# EAGLE design IPNS_v0.2 (EAGLE 8.0.0)
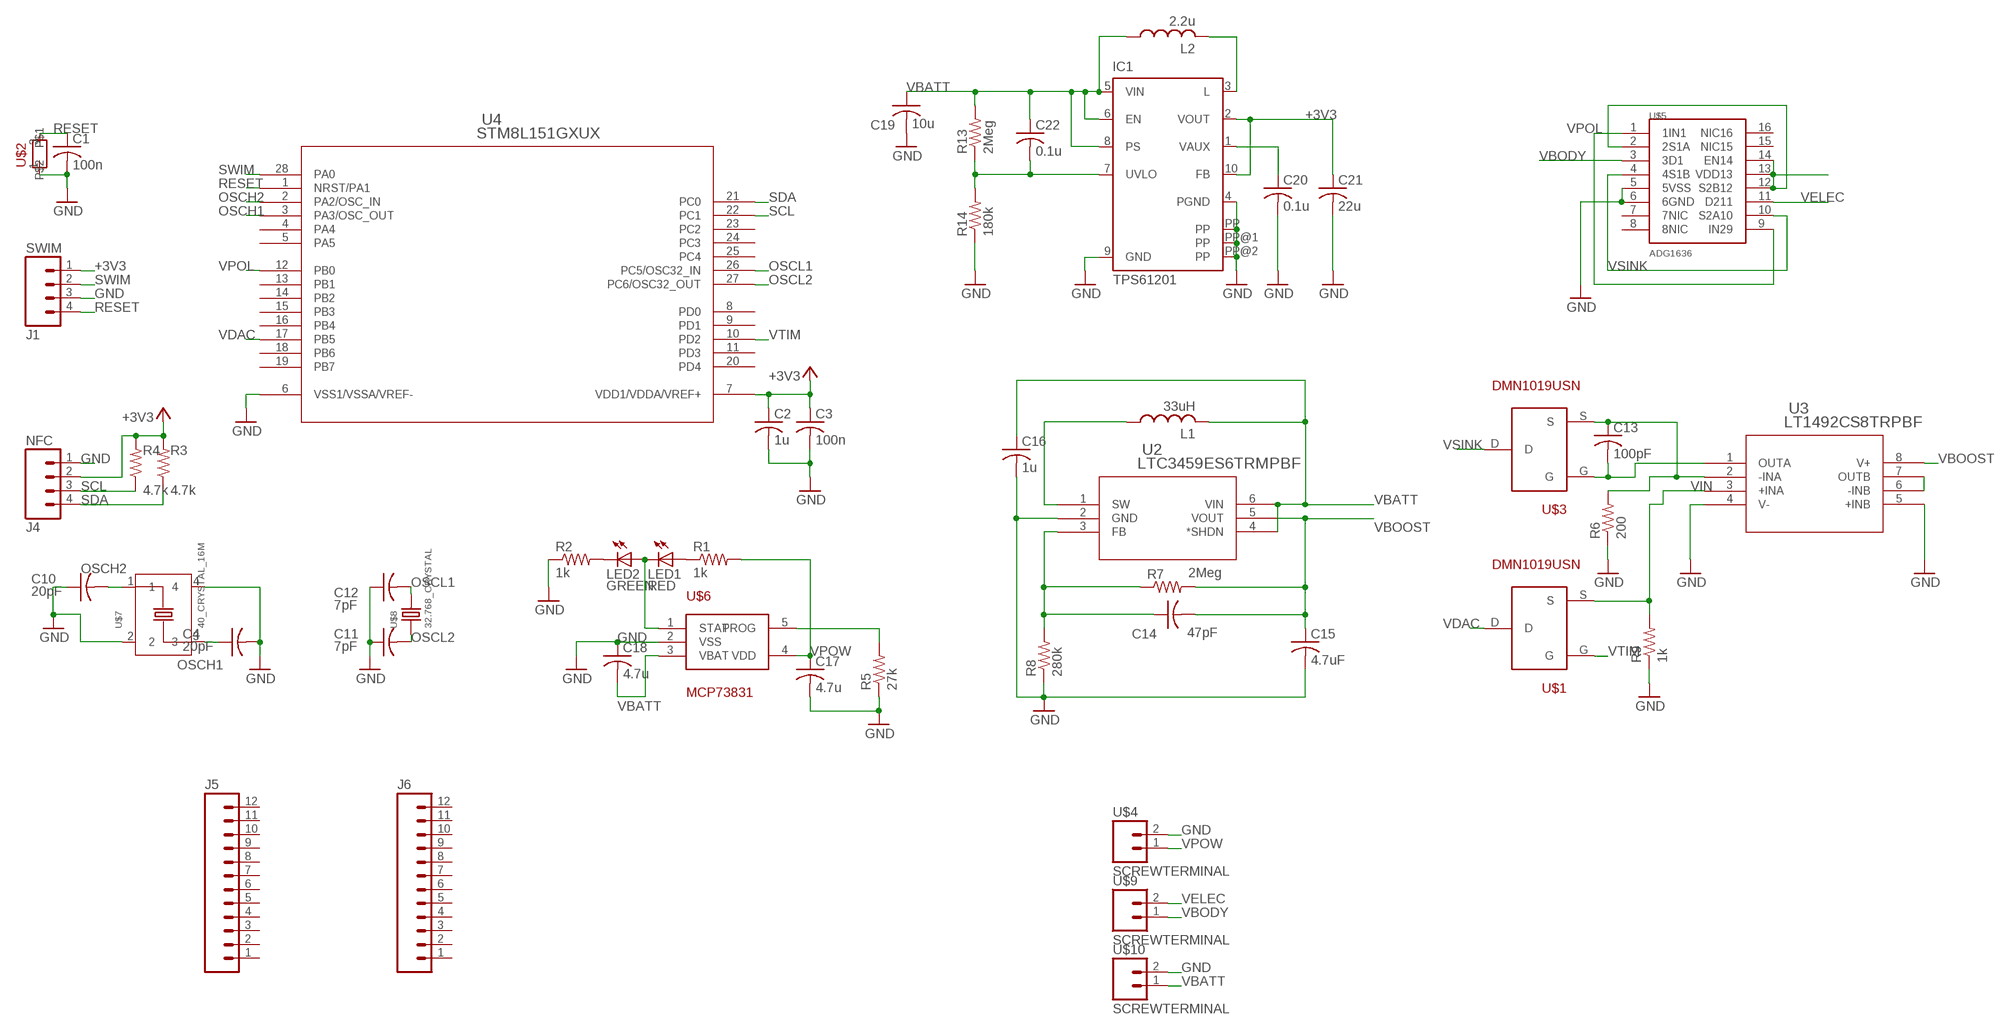
[diagram p0: schematic, sheet 1]

## Parts
C1  100n  C-USC0603  [C0603]
C2  1u  C-USC0603  [C0603]
C3  100n  C-USC0603  [C0603]
C4  20pF  C-USC0603  [C0603]
C10  20pF  C-USC0603  [C0603]
C11  7pF  C-USC0603  [C0603]
C12  7pF  C-USC0603  [C0603]
C13  100pF  C-USC0603  [C0603]
C14  47pF  C-USC0603  [C0603]
C15  4.7uF  C-USC0603  [C0603]
C16  1u  C-USC0603  [C0603]
C17  4.7u  C-USC0603  [C0603]
C18  4.7u  C-USC0603  [C0603]
C19  10u  C-USC0603  [C0603]
C20  0.1u  C-USC0603  [C0603]
C21  22u  C-USC0603  [C0603]
C22  0.1u  C-USC0603  [C0603]
IC1  TPS61201  TPS61200  [S-PDSO-N10]
J1  SWIM  M04PTH  [1X04]
J4  NFC  M04PTH  [1X04]
J5  M12PTH  [1X12]
J6  M12PTH  [1X12]
L1  33uH  L-USL2012C  [L2012C]
L2  2.2u  L-USL2012C  [L2012C]
LED1  RED  LEDSML0603  [SML0603]
LED2  GREEN  LEDSML0603  [SML0603]
R1  1k  R-US_R0603  [R0603]
R2  1k  R-US_R0603  [R0603]
R3  4.7k  R-US_R0603  [R0603]
R4  4.7k  R-US_R0603  [R0603]
R5  27k  R-US_R0603  [R0603]
R6  200  R-US_R0603  [R0603]
R7  2Meg  R-US_R0603  [R0603]
R8  280k  R-US_R0603  [R0603]
R9  1k  R-US_R0603  [R0603]
R13  2Meg  R-US_R0603  [R0603]
R14  180k  R-US_R0603  [R0603]
U2  LTC3459ES6TRMPBF  [TSOT-23_S6]
U3  LT1492CS8TRPBF  [SO-8_S]
U4  STM8L151GXUX  [UFQFPN-28]
U$1  DMN1019USN  [DMN1019USN]
U$2  PUSH-BUTTON  [PUSH-BUTTON]
U$3  DMN1019USN  [DMN1019USN]
U$4  SCREWTERMINAL  [SCREWTERMINAL]
U$5  ADG1636  [TSSOP16]
U$6  MCP78381  [SOT23-5L]
U$7  40_CRYSTAL_16M  [X4-SMD-3.2X2.5X0.7MM]
U$8  32.768_CRYSTAL  [X2-SMD-3.2X1.5X0.55MM]
U$9  SCREWTERMINAL  [SCREWTERMINAL]
U$10  SCREWTERMINAL  [SCREWTERMINAL]

## Nets
+3V3: C2.1 C3.1 C21.1 IC1.2(VOUT) IC1.10(FB) J1.1 J4.2 R3.2 R4.2 U4.7(VDD1/VDDA/VREF+)
GND: C1.2 C2.2 C3.2 C4.2 C10.1 C11.1 C12.1 C15.2 C16.2 C17.2 C18.1 C19.2 C20.2 C21.2 IC1.4(PGND) IC1.9(GND) IC1.PP IC1.PP@1(PP) IC1.PP@2(PP) J1.3 J4.1 R2.1 R5.1 R6.1 R8.1 R9.1 R14.1 U2.2(GND) U3.4(V-) U3.5(+INB) U4.6(VSS1/VSSA/VREF-) U$2.1 U$4.2 U$5.5(5VSS) U$5.6(6GND) U$6.2(VSS) U$7.2 U$7.4 U$10.2
N$1: LED1.C LED2.A U$6.1(STAT)
N$2: C13.1 R6.2 U3.2(-INA) U$3.S
N$4: U3.6(-INB) U3.7(OUTB)
N$7: C14.1 R7.1 R8.2 U2.3(FB)
N$8: L1.1 U2.1(SW)
N$10: LED2.C R2.2
N$11: LED1.A R1.1
N$12: C13.2 U3.1(OUTA) U$3.G
N$13: R5.2 U$6.5(PROG)
N$14: IC1.3(L) L2.2
N$17: C20.1 IC1.1(VAUX)
N$18: C22.2 IC1.7(UVLO) R13.1 R14.2
N$22: U$5.2(2S1A) U$5.12(S2B12) U$5.13(VDD13) U$5.14(EN14)
OSCH1: C4.1 U4.3(PA3/OSC_OUT) U$7.3
OSCH2: C10.2 U4.2(PA2/OSC_IN) U$7.1
OSCL1: C12.2 U4.26(PC5/OSC32_IN) U$8.2
OSCL2: C11.2 U4.27(PC6/OSC32_OUT) U$8.1
RESET: C1.1 J1.4 U4.1(NRST/PA1) U$2.3
SCL: J4.3 R4.1 U4.22(PC1)
SDA: J4.4 R3.1 U4.21(PC0)
SWIM: J1.2 U4.28(PA0)
VBATT: C16.1 C18.2 C19.1 C22.1 IC1.5(VIN) IC1.6(EN) IC1.8(PS) L1.2 L2.1 R13.2 U2.4(*SHDN) U2.6(VIN) U$6.3(VBAT) U$10.1
VBODY: U$5.3(3D1) U$9.1
VBOOST: C14.2 C15.1 R7.2 U2.5(VOUT) U3.8(V+)
VDAC: U4.17(PB5) U$1.D
VELEC: U$5.11(D211) U$9.2
VIN: R9.2 U3.3(+INA) U$1.S
VPOL: U4.12(PB0) U$5.1(1IN1) U$5.9(IN29)
VPOW: C17.1 R1.2 U$4.1 U$6.4(VDD)
VSINK: U$3.D U$5.4(4S1B) U$5.10(S2A10)
VTIM: U4.10(PD2) U$1.G
Unconnected: J5.1 J5.2 J5.3 J5.4 J5.5 J5.6 J5.7 J5.8 J5.9 J5.10 J5.11 J5.12 J6.1 J6.2 J6.3 J6.4 J6.5 J6.6 J6.7 J6.8 J6.9 J6.10 J6.11 J6.12 U4.4(PA4) U4.5(PA5) U4.8(PD0) U4.9(PD1) U4.11(PD3) U4.13(PB1) U4.14(PB2) U4.15(PB3) U4.16(PB4) U4.18(PB6) U4.19(PB7) U4.20(PD4) U4.23(PC2) U4.24(PC3) U4.25(PC4) U$5.7(7NIC) U$5.8(8NIC) U$5.15(NIC15) U$5.16(NIC16)

## Library data of the parts
C1-C4 C10-C16 = IPNS_Lib_v0.1:C-US: CAPACITOR, American symbol
C17-C19 = IPNS_Lib:C-US: CAPACITOR, American symbol
C20-C22 = rcl:C-US: CAPACITOR, American symbol
IC1 = IPNS_Lib:TPS6120*: LOW INPUT VOLTAGE SYNCHRONOUS BOOST CONVERTER WITH 1.3-A SWITCHES Source: http://focus.ti.com/lit/ds/symlink/tps61200.pdf; MPN: TPS61200DRCT; OC_FARNELL: 1471238; OC_NEWARK: 37M0066
J1 J4 = IPNS_Lib_v0.1:M04: Header 4 Standard 4-pin 0.1" header. Use with straight break away headers (SKU : PRT-00116), right angle break away headers (PRT-00553), swiss pins (PRT-00743), machine pins (PRT-00117), and female headers (PRT-00115). Molex polarized connector foot print use with SKU : PRT-08231 with associated crimp pins and housings. 1MM SMD Version SKU: PRT-10208; PROD_ID: CONN-09696
J5 J6 = IPNS_Lib:M12: Header 12 Standard 12-pin 0.1" header. Use with straight break away headers (SKU : PRT-00116), right angle break away headers (PRT-00553), swiss pins (PRT-00743), machine pins (PRT-00117), and female headers (PRT-00115).
L1 = IPNS_Lib_v0.1:L-US: INDUCTOR, American symbol
L2 = rcl:L-US: INDUCTOR, American symbol
LED1 LED2 = IPNS_Lib:LED: LED OSRAM: - CHIPLED LG R971, LG N971, LY N971, LG Q971, LY Q971, LO R971, LY R971 LH N974, LH R974 LS Q976, LO Q976, LY Q976 LO Q996 - Hyper CHIPLED LW Q18S LB Q993, LB Q99A, LB R99A - SideLED LS A670, LO A670, LY A670, LG A670, LP A670 LB A673, LV A673, LT A673, LW A673 LH A674 LY A675 LS A676, LA A676, LO A676, LY A676, LW A676 LS A679, LY A679, LG A679 - Hyper Micro SIDELED® LS Y876, LA Y876, LO Y876, LY Y876 LT Y87S - SmartLED LW L88C, LW L88S LB L89C, LB L89S, LG L890 LS L89K, LO L89K, LY L89K LS L896, LA L896, LO L896, LY L896 - TOPLED LS T670, LO T670, LY T670, LG T670, LP T670 LSG T670, LSP T670, LSY T670, LOP T670, LYG T670 LG T671, LOG T671, LSG T671 LB T673, LV T673, LT T673, LW T673 LH T674 LS T676, LA T676, LO T676, LY T676, LB T676, LH T676, LSB T676, LW T676 LB T67C, LV T67C, LT T67C, LS T67K, LO T67K, LY T67K, LW E67C LS E67B, LA E67B, LO E67B, LY E67B, LB E67C, LV E67C, LT E67C LW T67C LS T679, LY T679, LG T679 LS T770, LO T770, LY T770, LG T770, LP T770 LB T773, LV T773, LT T773, LW T773 LH T774 LS E675, LA E675, LY E675, LS T675 LS T776, LA T776, LO T776, LY T776, LB T776 LHGB T686 LT T68C, LB T68C - Hyper Mini TOPLED® LB M676 - Mini TOPLED Santana® LG M470 LS M47K, LO M47K, LY M47K Source: http://www.osram.convergy.de LUXEON: - LUMILED® LXK2-PW12-R00, LXK2-PW12-S00, LXK2-PW14-U00, LXK2-PW14-V00 LXK2-PM12-R00, LXK2-PM12-S00, LXK2-PM14-U00 LXK2-PE12-Q00, LXK2-PE12-R00, LXK2-PE12-S00, LXK2-PE14-T00, LXK2-PE14-U00 LXK2-PB12-K00, LXK2-PB12-L00, LXK2-PB12-M00, LXK2-PB14-N00, LXK2-PB14-P00, LXK2-PB14-Q00 LXK2-PR12-L00, LXK2-PR12-M00, LXK2-PR14-Q00, LXK2-PR14-R00 LXK2-PD12-Q00, LXK2-PD12-R00, LXK2-PD12-S00 LXK2-PH12-R00, LXK2-PH12-S00 LXK2-PL12-P00, LXK2-PL12-Q00, LXK2-PL12-R00 Source: www.luxeon.com KINGBRIGHT: KA-3528ASYC Source: www.kingbright.com
R1 R2 R5 = IPNS_Lib:R-US_: RESISTOR, American symbol
R3 R4 R6-R9 = IPNS_Lib_v0.1:R-US_: RESISTOR, American symbol
R13 R14 = rcl:R-US_: RESISTOR, American symbol
U2 = IPNS_Lib_v0.1:LTC3459ES6TRMPBF; COPYRIGHT: Copyright (C) 2016 Accelerated Designs. All rights reserved; MANUFACTURER_PART_NUMBER: ltc3459es6#trmpbf; VENDOR: Linear Technology
U3 = IPNS_Lib_v0.1:LT1492CS8TRPBF; MANUFACTURER_PART_NUMBER: lt1492cs8#trpbf; VENDOR: Linear Technology
U4 = IPNS_Lib:STM8L151GXUX; COPYRIGHT: Copyright (C) 2016 Accelerated Designs. All rights reserved; MANUFACTURER_PART_NUMBER: stm8l151gxux; VENDOR: ST Microelectronics
U$1 U$3 = IPNS_Lib:DMN1019USN
U$2 = IPNS_Lib_v0.1:PUSH-BUTTON
U$4 U$9 U$10 = IPNS_Lib:SCREWTERMINAL
U$5 = IPNS_Lib:ADG1636
U$6 = IPNS_Lib:MCP78381
U$7 = IPNS_Lib:40_CRYSTAL_16M
U$8 = IPNS_Lib:32.768_CRYSTAL

## Net classes
0 default: width 0.152 mm, drill 0.381 mm, clearance 0.152 mm

## Board
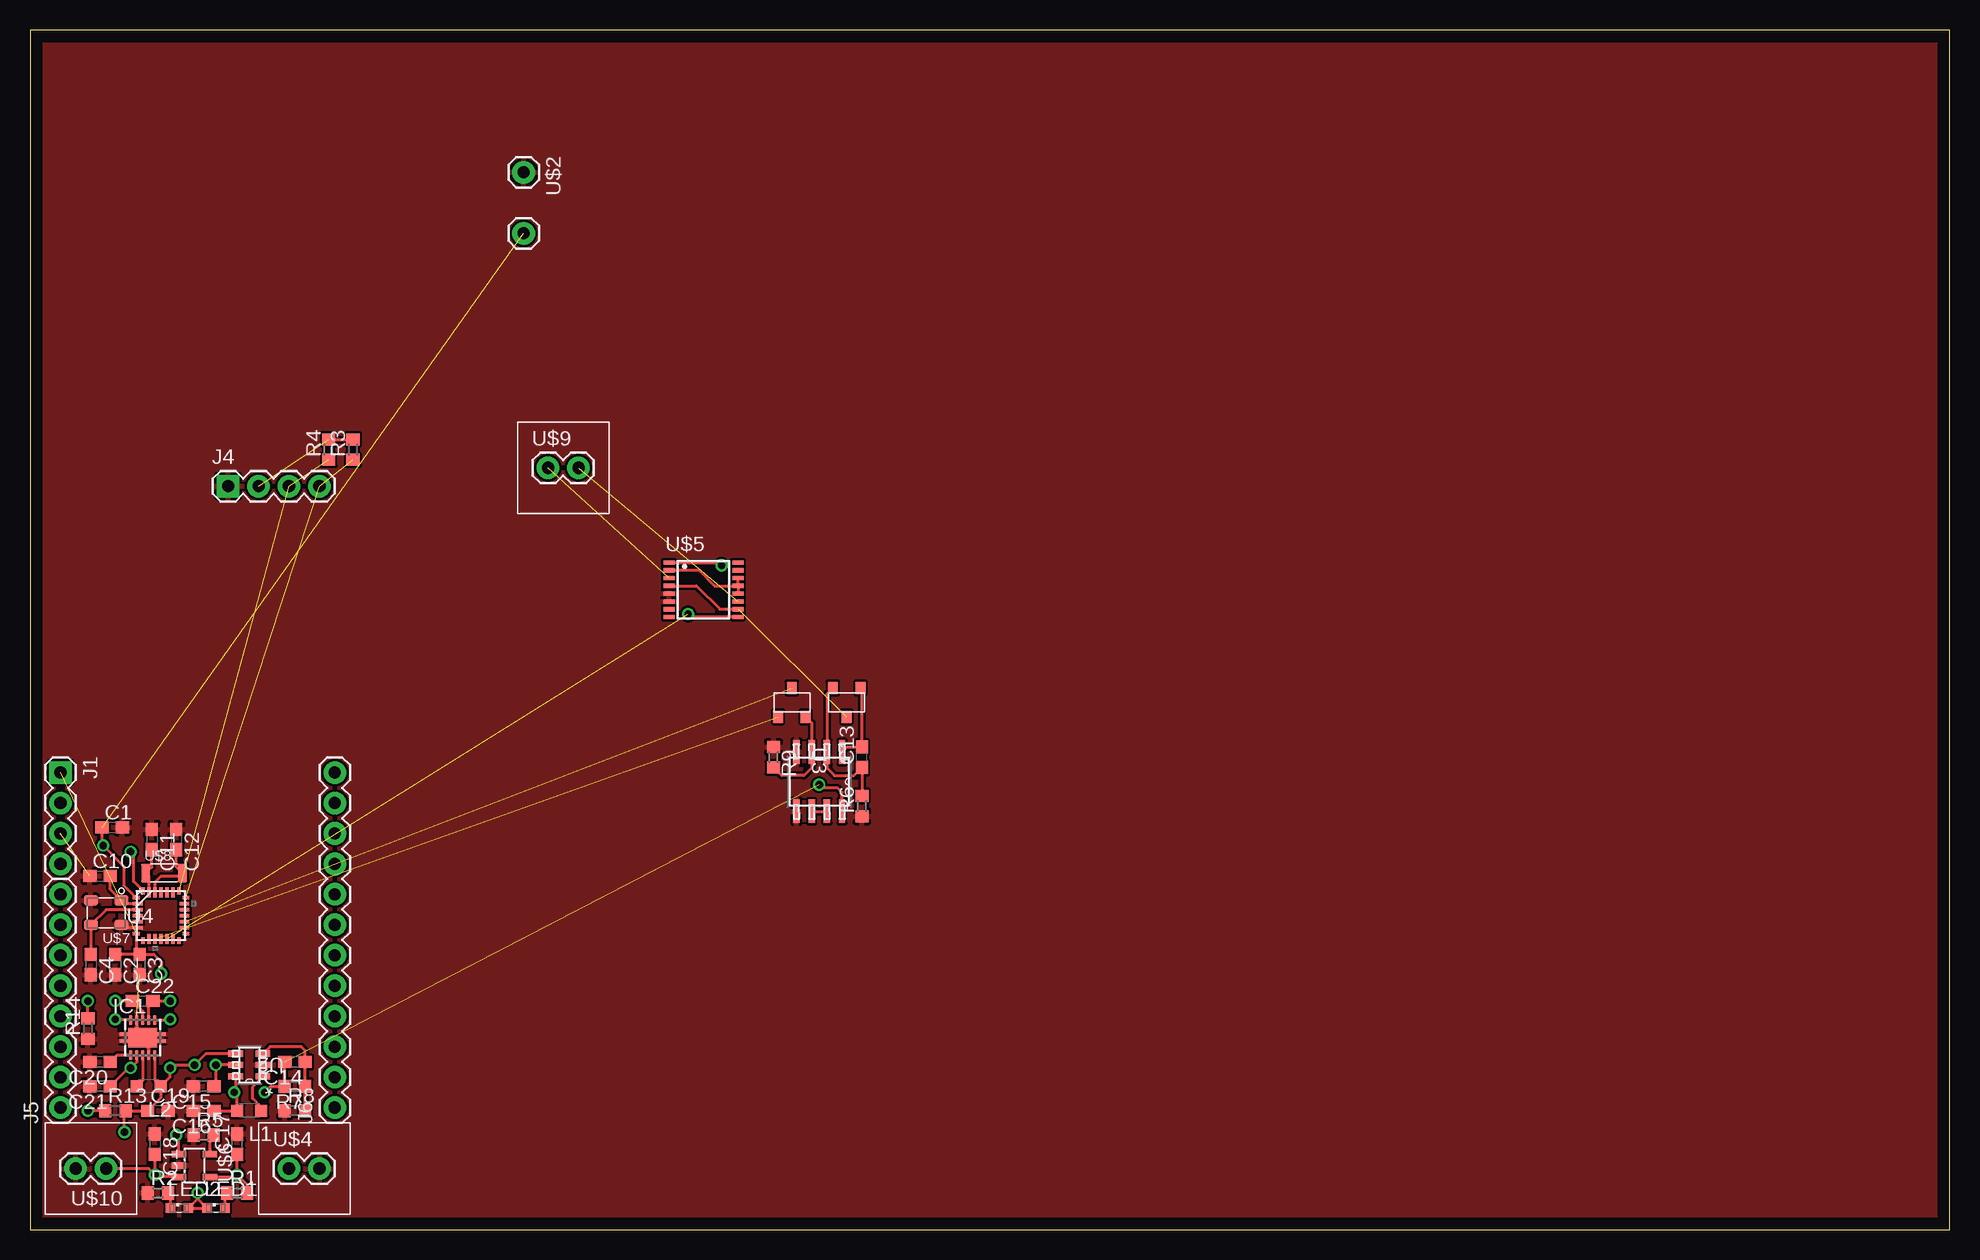
[diagram p1: board, top side]
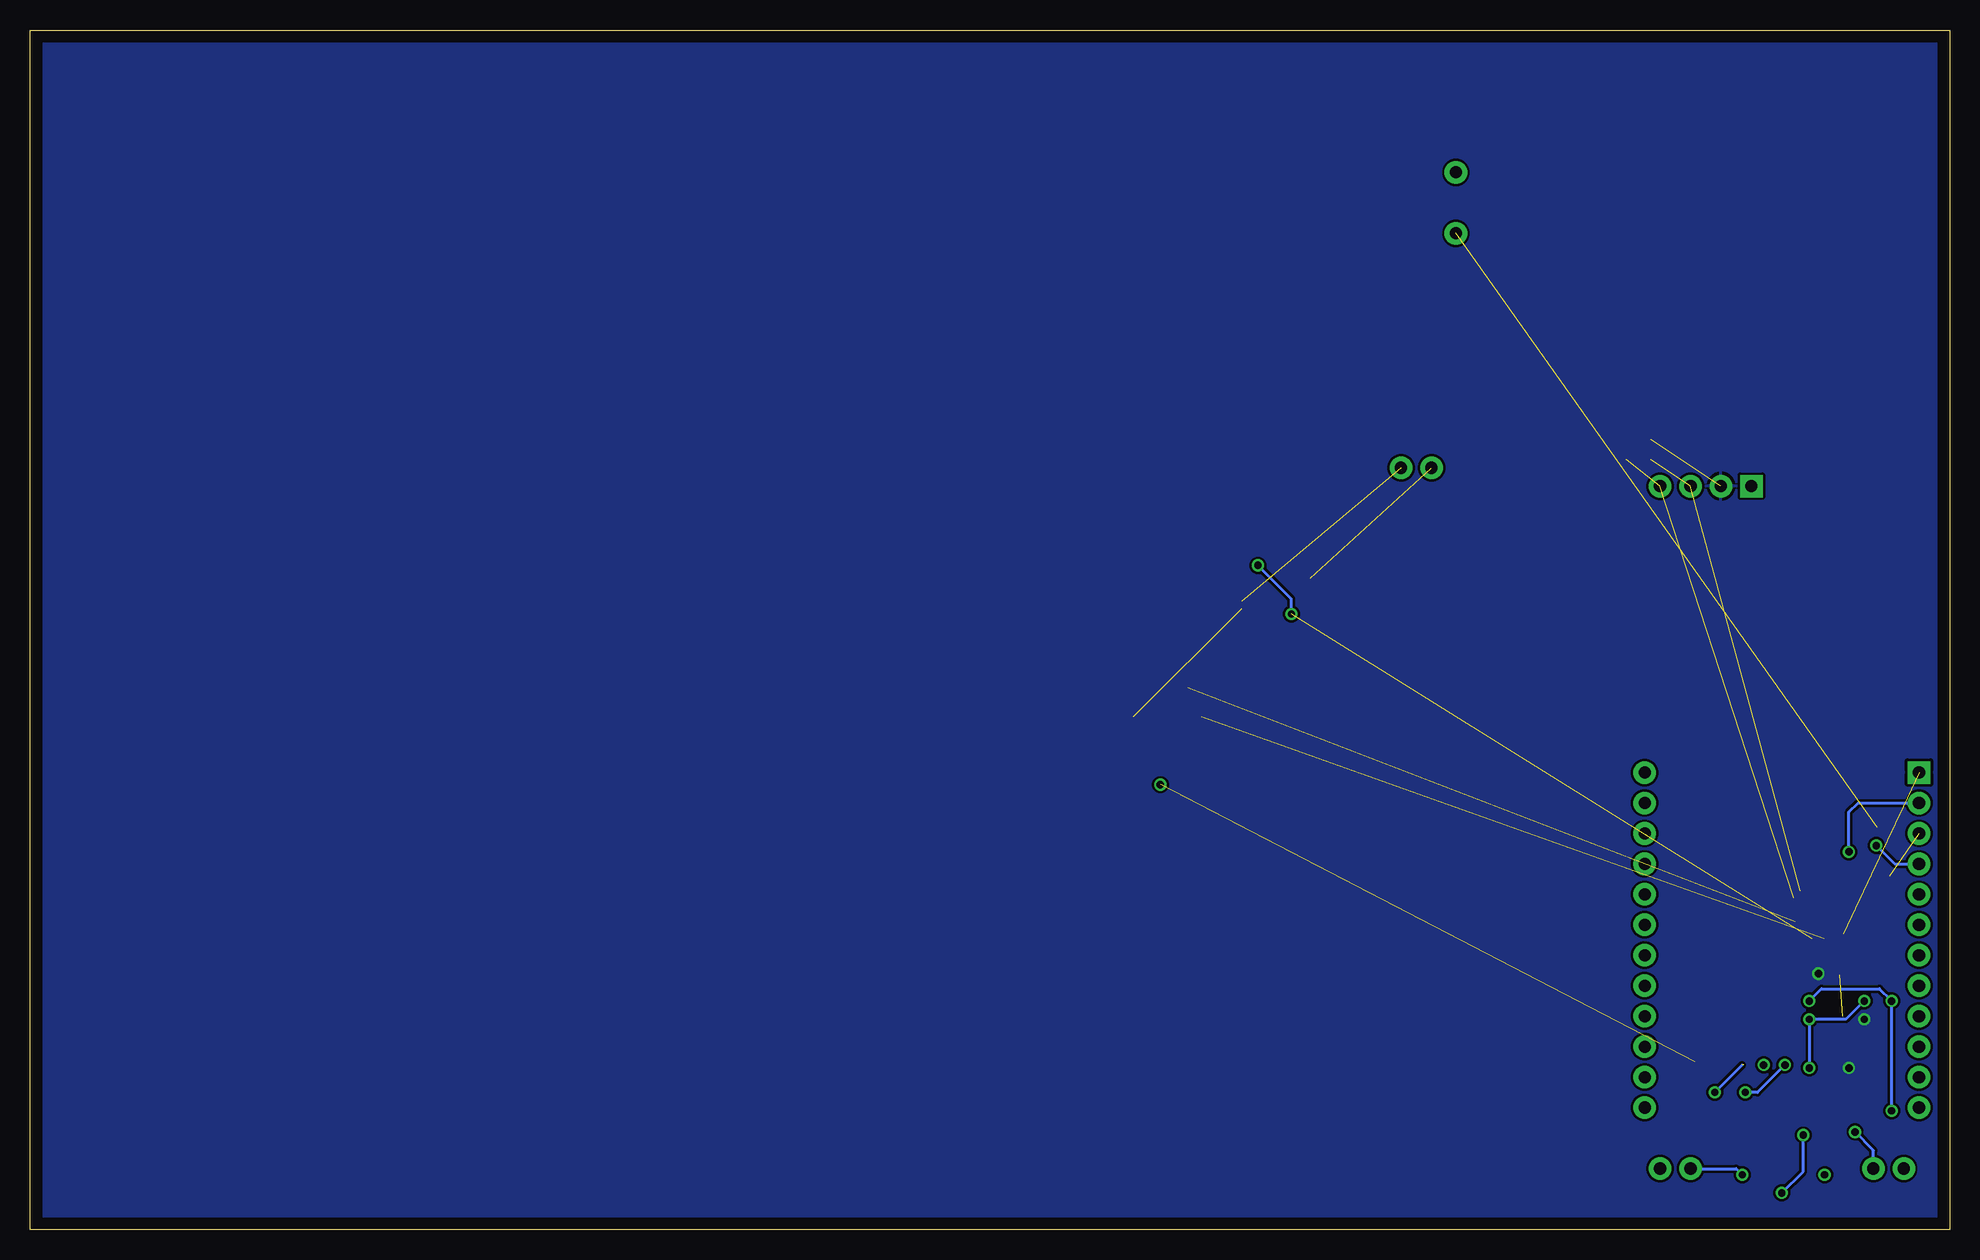
[diagram p2: board, bottom side, seen from below]

Size 160 x 100 mm. Coordinates in mm from the lower left corner, seen from the top.
Outline: 0,0 160,0 160,100 0,100 0,0
Copper layers (1*16): Top 0.035mm / dielectric 1.5mm / Bottom 0.035mm
Design rules "default": minimum track width 10mil, minimum drill 24mil, track to track 8mil, track to pad 8mil, pad to pad 8mil, via to via 8mil, smd to smd 8mil, copper to edge 40mil, drill to drill 8mil, minimum pad ring 10mil, minimum via ring 8mil, stop-mask expansion 4mil, vias tented up to drill 0mil, thermal gap 10mil

### Footprints (pad centres in the part's own frame; a part is rotated, then mirrored left to right if it is on the bottom)
C0603 = smd 1.1 x 1: 1 -0.85,0; 2 0.85,0
S-PDSO-N10 = smd 0.28 x 0.85: 1 -1,-1.475; 2 -0.5,-1.475; 3 0,-1.475; 4 0.5,-1.475; 5 1,-1.475; 6 1,1.475; 7 0.5,1.475; 8 0,1.475; 9 -0.5,1.475; 10 -1,1.475 | smd 2.4 x 1.65: PP 0,0 | smd 3.8 x 0.28: PP@1 0,0.275; PP@2 0,-0.275
1X04 = drill 1.016 pad 1.88 square: 1 0,0 | drill 1.016 pad 1.88: 2 2.54,0; 3 5.08,0; 4 7.62,0
1X12 = drill 1.016 pad 1.88: 1 0,0; 2 2.54,0; 3 5.08,0; 4 7.62,0; 5 10.16,0; 6 12.7,0; 7 15.24,0; 8 17.78,0; 9 20.32,0; 10 22.86,0; 11 25.4,0; 12 27.94,0
L2012C = smd 1 x 1: 1 -1,0; 2 1,0
SML0603 = smd 0.8 x 0.8: A 0.75,0; C -0.75,0
R0603 = smd 1 x 1.1: 1 -0.85,0; 2 0.85,0
TSOT-23_S6 = smd 1.219 x 0.508: 1 -1.143,0.95; 2 -1.143,0; 3 -1.143,-0.95; 4 1.143,-0.95; 5 1.143,0; 6 1.143,0.95
SO-8_S = smd 1.981 x 0.533: 1 -2.464,1.905; 2 -2.464,0.635; 3 -2.464,-0.635; 4 -2.464,-1.905; 5 2.464,-1.905; 6 2.464,-0.635; 7 2.464,0.635; 8 2.464,1.905
UFQFPN-28 = smd 0.559 x 0.305: 1 -2.07,1.5; 7 -2.07,-1.5; 15 2.07,-1.5; 21 2.07,1.5 | smd 0.813 x 0.305: 2 -1.943,1; 3 -1.943,0.5; 4 -1.943,0; 5 -1.943,-0.5; 6 -1.943,-1; 16 1.943,-1; 17 1.943,-0.5; 18 1.943,0; 19 1.943,0.5; 20 1.943,1 | smd 0.305 x 0.559: 8 -1.5,-2.07; 14 1.5,-2.07; 22 1.5,2.07; 28 -1.5,2.07 | smd 0.305 x 0.813: 9 -1,-1.943; 10 -0.5,-1.943; 11 0,-1.943; 12 0.5,-1.943; 13 1,-1.943; 23 1,1.943; 24 0.5,1.943; 25 0,1.943; 26 -0.5,1.943; 27 -1,1.943
DMN1019USN = smd 1.016 x 0.813: D 1.2,0; G -1.2,1.15; S -1.2,-1.15
PUSH-BUTTON = drill 1.016 pad 1.88: 1 -2.54,0; 3 2.54,0
SCREWTERMINAL = drill 1.016 pad 1.88: 1 -1.27,0; 2 1.27,0
TSSOP16 = smd 0.9 x 0.35: 1 -2.875,2.275; 2 -2.875,1.625; 3 -2.875,0.975; 4 -2.875,0.325; 5 -2.875,-0.325; 6 -2.875,-0.975; 7 -2.875,-1.625; 8 -2.875,-2.275; 9 2.875,-2.275; 10 2.875,-1.625; 11 2.875,-0.975; 12 2.875,-0.325; 13 2.875,0.325; 14 2.875,0.975; 15 2.875,1.625; 16 2.875,2.275
SOT23-5L = smd 0.55 x 1.2: 1 -0.95,-1.3; 2 0,-1.3; 3 0.95,-1.3; 4 0.95,1.3; 5 -0.95,1.3
X4-SMD-3.2X2.5X0.7MM = smd 1.143 x 0.889: 1 -1.27,-1.016; 2 1.27,-1.016; 3 1.27,1.016; 4 -1.27,1.016
X2-SMD-3.2X1.5X0.55MM = smd 0.762 x 1.524: 1 -1.524,0; 2 1.524,0

### Placement (x,y rotation side)
C1  6.86,33.53 0 top
C2  7.11,22.1 270 top
C3  9.14,22.1 270 top
C4  5.08,22.1 270 top
C10  5.84,29.46 0 top
C11  10.16,32.51 270 top
C12  12.19,32.51 270 top
C13  69.34,39.37 90 top
C14  22.1,13.97 180 top
C15  14.48,11.94 180 top
C16  14.48,9.91 180 top
C17  17.27,7.11 90 top
C18  10.41,7.11 270 top
C19  10.67,9.91 0 top
C20  5.84,13.97 180 top
C21  5.84,11.94 180 top
C22  9.4,19.05 0 top
IC1  9.4,16 0 top
J1  2.54,38.1 270 top
J4  16.51,61.98 0 top
J5  2.54,10.16 90 top
J6  25.4,10.16 90 top
L1  18.29,9.91 180 top
L2  9.91,11.94 180 top
LED1  15.49,1.78 0 top
LED2  12.45,1.78 0 top
R1  17.27,3.05 0 top
R2  10.67,3.05 0 top
R3  26.92,65.02 90 top
R4  24.89,65.02 90 top
R5  14.48,7.87 0 top
R6  69.34,35.31 90 top
R7  22.1,11.94 180 top
R8  22.1,9.91 0 top
R9  61.98,39.37 270 top
R13  7.11,9.91 0 top
R14  4.83,16.76 90 top
U2  18.29,13.72 180 top
U3  65.79,37.34 270 top
U4  10.92,26.16 0 top
U$1  63.5,43.94 90 top
U$2  41.15,85.6 270 top
U$3  68.07,43.94 270 top
U$4  22.86,5.08 0 top
U$5  56.13,53.34 0 top
U$6  13.72,5.33 270 top
U$7  6.35,26.42 180 top
U$8  11.18,29.72 0 top
U$9  44.45,63.5 0 top
U$10  5.08,5.08 180 top

### Tracks (layer width: path | path; a pad name or v marks a point on that pad's centre or on a via)
+3V3  (via drill 0.6)  (2 unrouted)
  Top 0.254: U4.7 8.85,23.24 C3.1 | C3.1 C2.1 | C3.1 10.33,22.95 10.92,22.35 v10.92,21.34 | IC1.10 7.16,17.48 v7.11,17.53 | IC1.2 8.9,13.98 v8.38,13.46 8.22,13.46 C21.1 | R4.2 R3.2
  pour Bottom: -3.81,104.14 -3.81,-3.81 163.83,-3.81 167.64,-3.81 167.64,109.22 -3.81,109.22
GND  (2 unrouted)
  Top 0.254: 8.9,17.77 IC1.9 8.9,16 IC1.PP 9.9,16 IC1.4 | U4.6 7.86,25.16 U$7.4
  pour Top: -1.27,100.33 -1.27,-3.81 163.83,-3.81 163.83,102.87 -1.27,102.87
N$1  (via drill 0.6)
  Top 0.254: U$6.1 12.42,7.65 v12.19,7.87 | 13.97,2.55 LED2.A LED1.C 13.97,2.55 | 13.97,2.55 v13.97,3.05
  Bottom 0.254: v13.97,3.05 12.19,4.83 v12.19,7.87
N$2
  Top 0.254: R6.2 C13.1 68.67,37.85 67.06,37.85 66.42,38.48 U3.2 66.42,44.64 U$3.S
N$4
  Top 0.254: U3.6 U3.7
N$7
  Top 0.254: R8.2 R7.1 C14.1 22.95,14.9 22.61,15.24 20,15.24 U2.3
N$8
  Top 0.254: L1.1 19.29,10.18 18.54,10.92 18.54,11.88 U2.1
N$10
  Top 0.254: R2.2 11.7,2.87 LED2.C
N$11
  Top 0.254: R1.1 16.24,2.87 LED1.A
N$12
  Top 0.254: U$3.G 69.34,45.02 C13.2 68.11,40.22 U3.1
N$13
  Top 0.254: U$6.5 15.02,7.56 R5.2
N$14
  Top 0.254: IC1.3 9.4,12.43 L2.2
N$17
  Top 0.254: IC1.1 7.25,14.53 C20.1
N$18  (via drill 0.6)
  Top 0.254: IC1.7 9.9,18.7 C22.2 v11.68,19.05 | R13.1 v4.83,9.91 | R14.2 v4.83,19.05
  Bottom 0.254: v11.68,19.05 10.67,20.07 5.84,20.07 v4.83,19.05 v4.83,9.91
N$22
  Top 0.254: U$5.13 U$5.14 | U$5.13 U$5.12 | U$5.2 55.78,54.97 57.08,53.66 U$5.13
OSCH1
  Top 0.254: C4.1 U$7.3 6.34,26.66 U4.3
OSCH2
  Top 0.254: U4.2 7.89,27.16 U$7.1 6.69,28.36 C10.2
OSCL1
  Top 0.254: U4.26 10.42,28.96 10.92,29.46 12.45,29.46 U$8.2 12.19,30.23 C12.2
OSCL2
  Top 0.254: U4.27 9.92,29.45 U$8.1 10.16,30.23 C11.2
RESET  (via drill 0.6)  (1 unrouted)
  Top 0.254: U4.1 7.87,28.64 7.87,30.23 v6.1,32 6.01,32.09 C1.1
  Bottom 0.254: v6.1,32 4.57,30.48 J1.4
SCL  (2 unrouted)
SDA  (2 unrouted)
SWIM  (via drill 0.6)
  Top 0.254: U4.28 8.64,29.02 8.64,31.24 v8.38,31.5
  Bottom 0.254: v8.38,31.5 8.38,34.8 7.62,35.56 J1.2
VBATT  (via drill 0.6)
  Top 0.254: IC1.8 9.4,18.2 C22.1 v7.11,19.05 | IC1.6 11.63,17.48 v11.68,17.53 | IC1.5 10.4,12.45 L2.1 | L2.1 11.68,12.72 v11.68,13.46 11.94,13.72 v13.72,13.72 14.67,14.67 U2.4 17.21,14.67 | L2.1 10.91,10.99 C19.1 R13.2 7.87,9.82 v7.87,8.13 | U2.6 17.14,11.56 v17.02,11.43 17.29,11.16 L1.2 C16.1 | U$6.3 10.6,4.38 v10.41,4.57 | C18.2 v10.41,4.57 | U$10.1 9.91,5.08 v10.41,4.57
  Bottom 0.254: v11.68,13.46 v11.68,17.53 8.64,17.53 v7.11,19.05 | v13.72,13.72 16,11.43 v17.02,11.43 | U$10.1 6.35,6.6 v7.87,8.13
VBODY  (1 unrouted)
VBOOST  (via drill 0.6)  (2 unrouted)
  Top 0.254: v19.56,11.43 20.07,11.94 R7.2 C14.2 | U2.5 v15.49,13.72 15.49,12.1 C15.1 | U3.8 67.69,36.45 67.31,36.83 66.04,36.83 v65.79,37.08
  Bottom 0.254: 17.27,13.72 v19.56,11.43
VDAC  (1 unrouted)
VELEC  (1 unrouted)
VIN
  Top 0.254: R9.2 62.65,37.85 64.52,37.85 65.15,38.48 U3.3 65.15,42.24 U$1.S
VPOL  (via drill 0.6)  (1 unrouted)
  Top 0.254: U$5.9 55.11,51.06 v54.86,51.31 | U$5.1 57.41,55.62 v57.66,55.37
  Bottom 0.254: v54.86,51.31 54.86,52.58 v57.66,55.37
VPOW  (via drill 0.6)
  Top 0.254: U$6.4 17.08,4.38 v17.27,4.57 | v17.27,4.57 C17.1 | R1.2 18.12,3.72 v17.27,4.57
  Bottom 0.254: U$4.1 17.78,5.08 v17.27,4.57
VSINK  (1 unrouted)
  Top 0.254: U$5.4 55.55,53.66 57.51,51.72 U$5.10
VTIM  (1 unrouted)